# EAGLE design InductanceMeter_Rev1 (EAGLE 7.1.0)
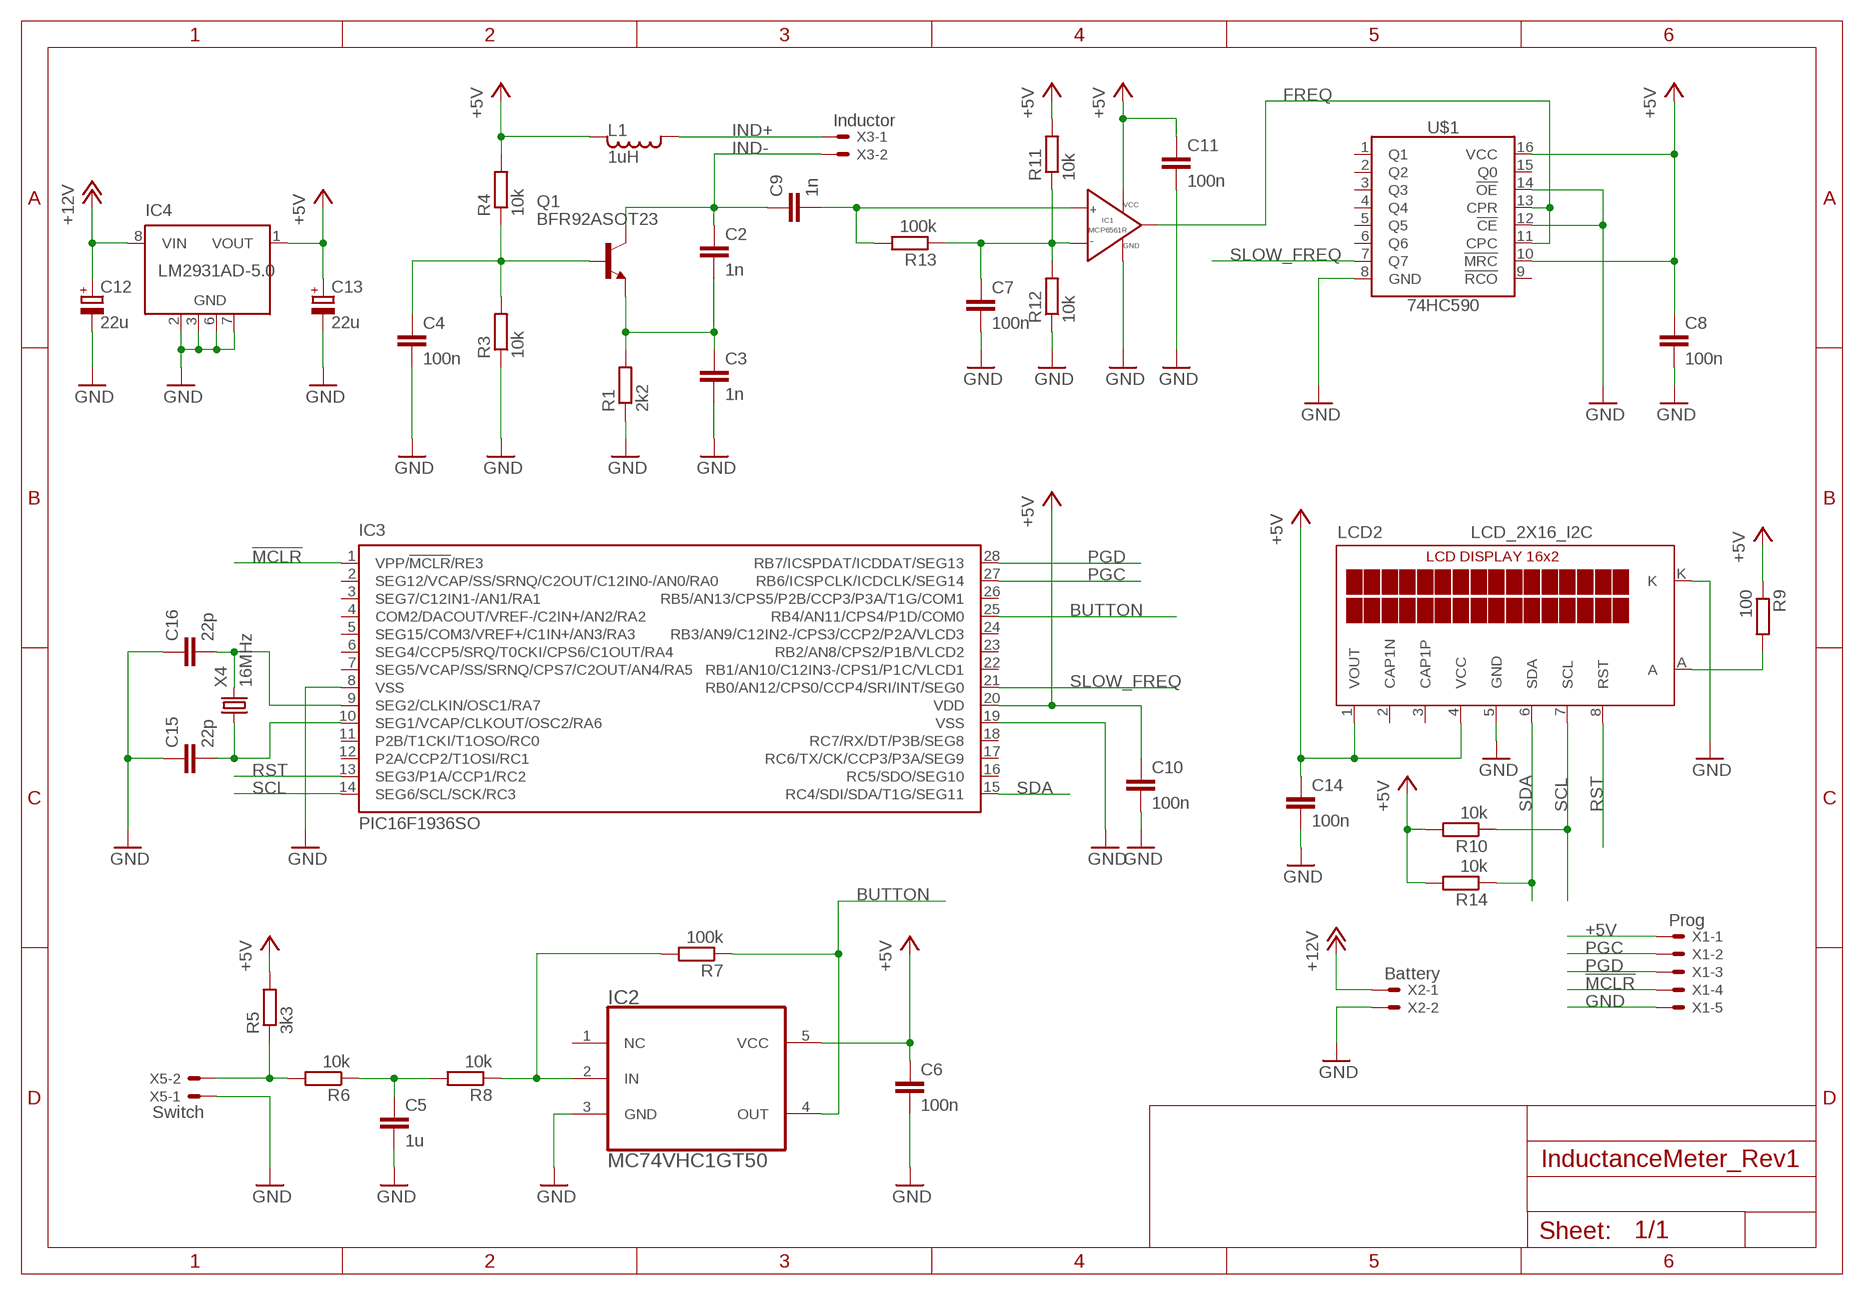
[diagram p0: schematic, sheet 1]

## Parts
C2  1n  CC0805  [C0805]
C3  1n  CC0805  [C0805]
C4  100n  CC0805  [C0805]
C5  1u  CC0805  [C0805]
C6  100n  CC0805  [C0805]
C7  100n  CC0805  [C0805]
C8  100n  CC0805  [C0805]
C9  1n  CC0805  [C0805]
C10  100n  CC0805  [C0805]
C11  100n  CC0805  [C0805]
C12  22u  C_POLARIZEDSMC_C  [SMC_C]
C13  22u  C_POLARIZEDSMC_C  [SMC_C]
C14  100n  CC0805  [C0805]
C15  22p  CC0805  [C0805]
C16  22p  CC0805  [C0805]
IC1  MCP6561R  [SOT-23-5]
IC2  MC74VHC1GT50  [SOT-23-5]
IC3  PIC16F1936SO  [SO28W]
IC4  LM2931AD-5.0  [SO8]
L1  1uH  INDUCTOR0805  [L0805]
LCD2  LCD_2X16_I2C  [LCD_2X16_I2C]
Q1  BFR92ASOT23  [SOT23]
R1  2k2  RESISTORR0805  [R0805]
R3  10k  RESISTORR0805  [R0805]
R4  10k  RESISTORR0805  [R0805]
R5  3k3  RESISTORR0805  [R0805]
R6  10k  RESISTORR0805  [R0805]
R7  100k  RESISTORR0805  [R0805]
R8  10k  RESISTORR0805  [R0805]
R9  100  RESISTORR0805  [R0805]
R10  10k  RESISTORR0805  [R0805]
R11  10k  RESISTORR0805  [R0805]
R12  10k  RESISTORR0805  [R0805]
R13  100k  RESISTORR0805  [R0805]
R14  10k  RESISTORR0805  [R0805]
U$1  74HC590  [SO16]
X1  Prog  22-23-2051  [22-23-2051]
X2  Battery  22-23-2021100MIL  [22-23-2021]
X3  Inductor  22-23-2021100MIL  [22-23-2021]
X4  16MHz  CRYSTAL  [CSM-7X-DU]
X5  Switch  22-23-2021100MIL  [22-23-2021]

## Nets
!MCLR!: IC3.1(VPP/!MCLR!/RE3) X1.4
+5V: C6.1 C8.1 C10.1 C11.1 C13.+ C14.1 IC1.2(VCC) IC2.5(VCC) IC3.20(VDD) IC4.1(VOUT) L1.2 LCD2.1(VOUT) LCD2.4(VCC) R4.2 R5.2 R9.1 R10.2 R11.2 R14.2 U$1.10(!MRC!) U$1.16(VCC) X1.1
+12V: C12.+ IC4.8(VIN) X2.1
BUTTON: IC2.4(OUT) IC3.25(RB4/AN11/CPS4/P1D/COM0) R7.1
FREQ: IC1.1(VOUT) U$1.11(CPC) U$1.13(CPR)
GND: C3.2 C4.2 C5.2 C6.2 C7.2 C8.2 C10.2 C11.2 C12.- C13.- C14.2 C15.1 C16.1 IC1.5(GND) IC2.3(GND) IC3.8(VSS) IC3.19(VSS) IC4.2(GND) IC4.3(GND) IC4.6(GND) IC4.7(GND) LCD2.5(GND) LCD2.K R1.1 R3.1 R12.1 U$1.8(GND) U$1.12(!CE!) U$1.14(!OE!) X1.5 X2.2 X5.1
IND+: L1.1 X3.1
IND-: C2.1 C9.1 Q1.3(C) X3.2
N$2: C16.2 IC3.9(SEG2/CLKIN/OSC1/RA7) X4.2
N$3: C2.2 C3.1 Q1.2(E) R1.2
N$4: C4.1 Q1.1(B) R3.2 R4.1
N$5: LCD2.A R9.2
N$6: C5.1 R6.1 R8.2
N$7: R5.1 R6.2 X5.2
N$8: IC2.2(IN) R7.2 R8.1
N$9: C15.2 IC3.10(SEG1/VCAP/CLKOUT/OSC2/RA6) X4.1
N$11: C7.1 IC1.4(VIN-) R11.1 R12.2 R13.1
N$12: C9.2 IC1.3(VIN+) R13.2
PGC: IC3.27(RB6/ICSPCLK/ICDCLK/SEG14) X1.2
PGD: IC3.28(RB7/ICSPDAT/ICDDAT/SEG13) X1.3
RST: IC3.13(SEG3/P1A/CCP1/RC2) LCD2.8(RST)
SCL: IC3.14(SEG6/SCL/SCK/RC3) LCD2.7(SCL) R10.1
SDA: IC3.15(RC4/SDI/SDA/T1G/SEG11) LCD2.6(SDA) R14.1
SLOW_FREQ: IC3.21(RB0/AN12/CPS0/CCP4/SRI/INT/SEG0) U$1.7(Q7)
Unconnected: IC2.1(NC) IC3.2(SEG12/VCAP/SS/SRNQ/C2OUT/C12IN0-/AN0/RA0) IC3.3(SEG7/C12IN1-/AN1/RA1) IC3.4(COM2/DACOUT/VREF-/C2IN+/AN2/RA2) IC3.5(SEG15/COM3/VREF+/C1IN+/AN3/RA3) IC3.6(SEG4/CCP5/SRQ/T0CKI/CPS6/C1OUT/RA4) IC3.7(SEG5/VCAP/SS/SRNQ/CPS7/C2OUT/AN4/RA5) IC3.11(P2B/T1CKI/T1OSO/RC0) IC3.12(P2A/CCP2/T1OSI/RC1) IC3.16(RC5/SDO/SEG10) IC3.17(RC6/TX/CK/CCP3/P3A/SEG9) IC3.18(RC7/RX/DT/P3B/SEG8) IC3.22(RB1/AN10/C12IN3-/CPS1/P1C/VLCD1) IC3.23(RB2/AN8/CPS2/P1B/VLCD2) IC3.24(RB3/AN9/C12IN2-/CPS3/CCP2/P2A/VLCD3) IC3.26(RB5/AN13/CPS5/P2B/CCP3/P3A/T1G/COM1) LCD2.2(CAP1N) LCD2.3(CAP1P) U$1.1(Q1) U$1.2(Q2) U$1.3(Q3) U$1.4(Q4) U$1.5(Q5) U$1.6(Q6) U$1.9(!RCO!) U$1.15(Q0)

## Library data of the parts
C2-C11 C14-C16 = 00Capacitor:C: Capacitor
C12 C13 = 00Capacitor:C_POLARIZED
IC1 = 00OpAmp:MCP6561R: 1.8V Low-Power Push-Pull Output Comparator Propagation delay 80ns max
IC2 = 00Logic:MC74VHC1GT50: Non-Inverting Buffer / Level Shifter
IC3 = 00PIC:PIC16F19*: Flash-Based, 8-Bit CMOS Microcontroller; EEPROM: 256; FLASH: 8192; RAM: 512
IC4 = 00VoltageRegulator:LM2931*
L1 = 00Inductor:INDUCTOR
LCD2 = 00Display:LCD_2X16_I2C: 2x16 LCD with I2C interface
Q1 = 00Transistor:BFR92A
R1 R3-R14 = 00Resistor:RESISTOR: RESISTOR, European symbol
U$1 = 00Logic:74HC590: 8-bit binary counter with output register; 3-state
X1 = 00Connector:22-23-2051: .100" (2.54mm) Center Header - 5 Pin; MF: MOLEX; MPN: 22-23-2051; OC_FARNELL: 1462952; OC_NEWARK: 38C9178
X2 X3 X5 = 00Connector:22-23-2021: .100" (2.54mm) Center Header - 2 Pin; MF: MOLEX; MPN: 22-23-2021; OC_FARNELL: 1462926; OC_NEWARK: 25C3832
X4 = 00Crystal:CRYSTAL: Crystal

## Board
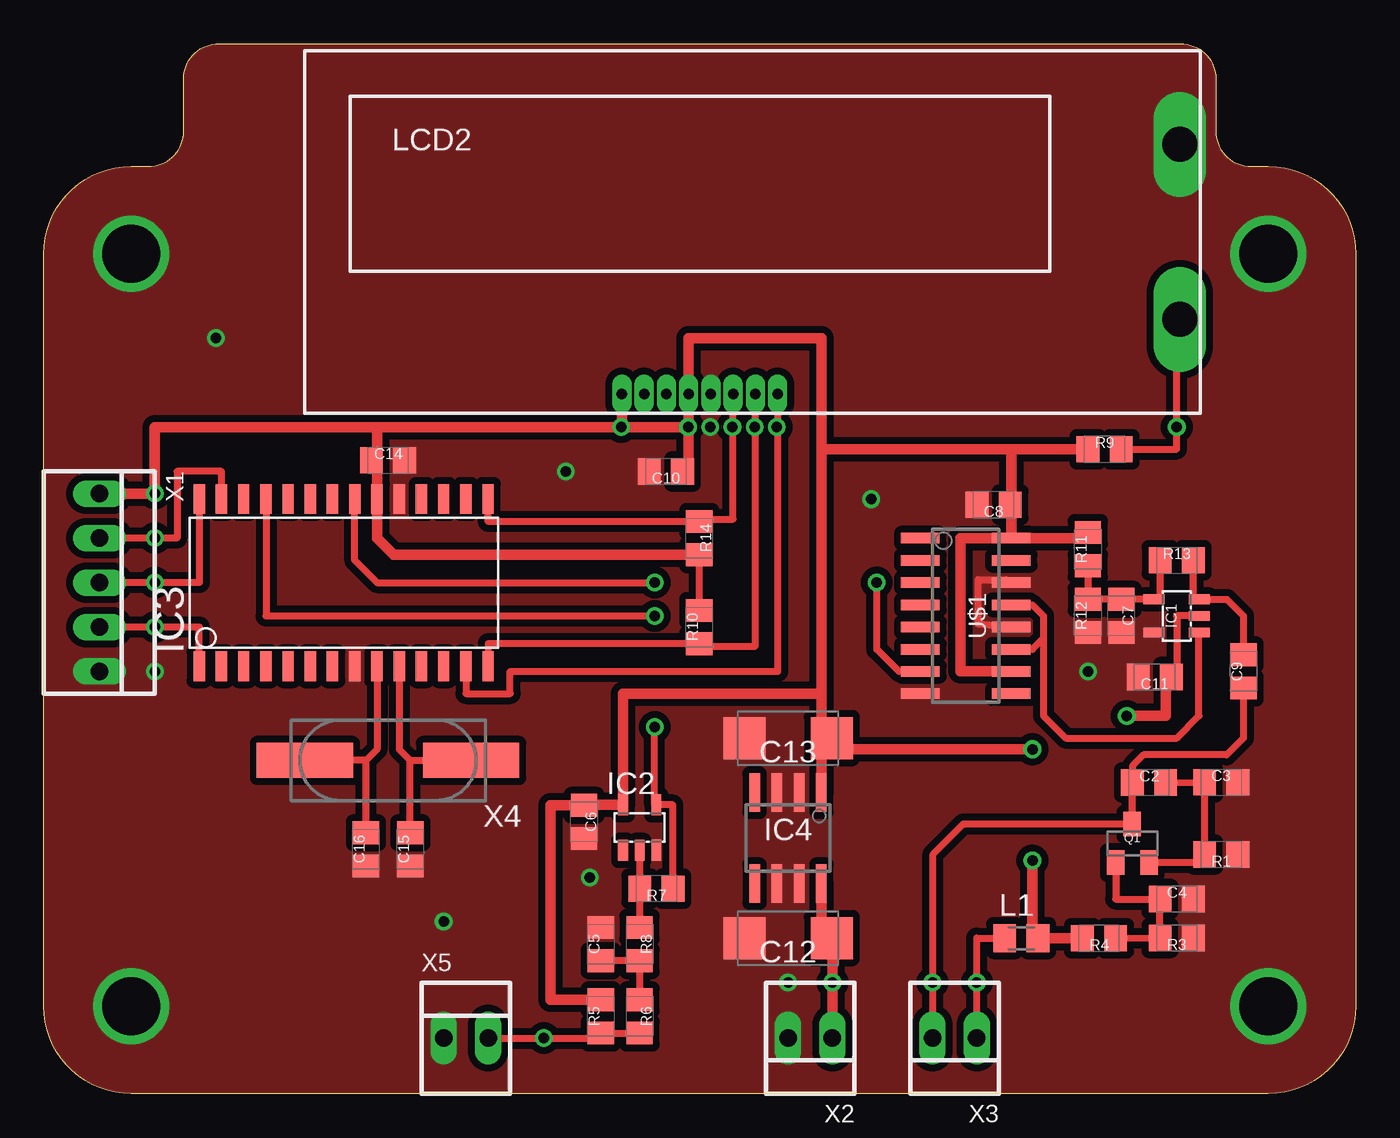
[diagram p1: board, top side]
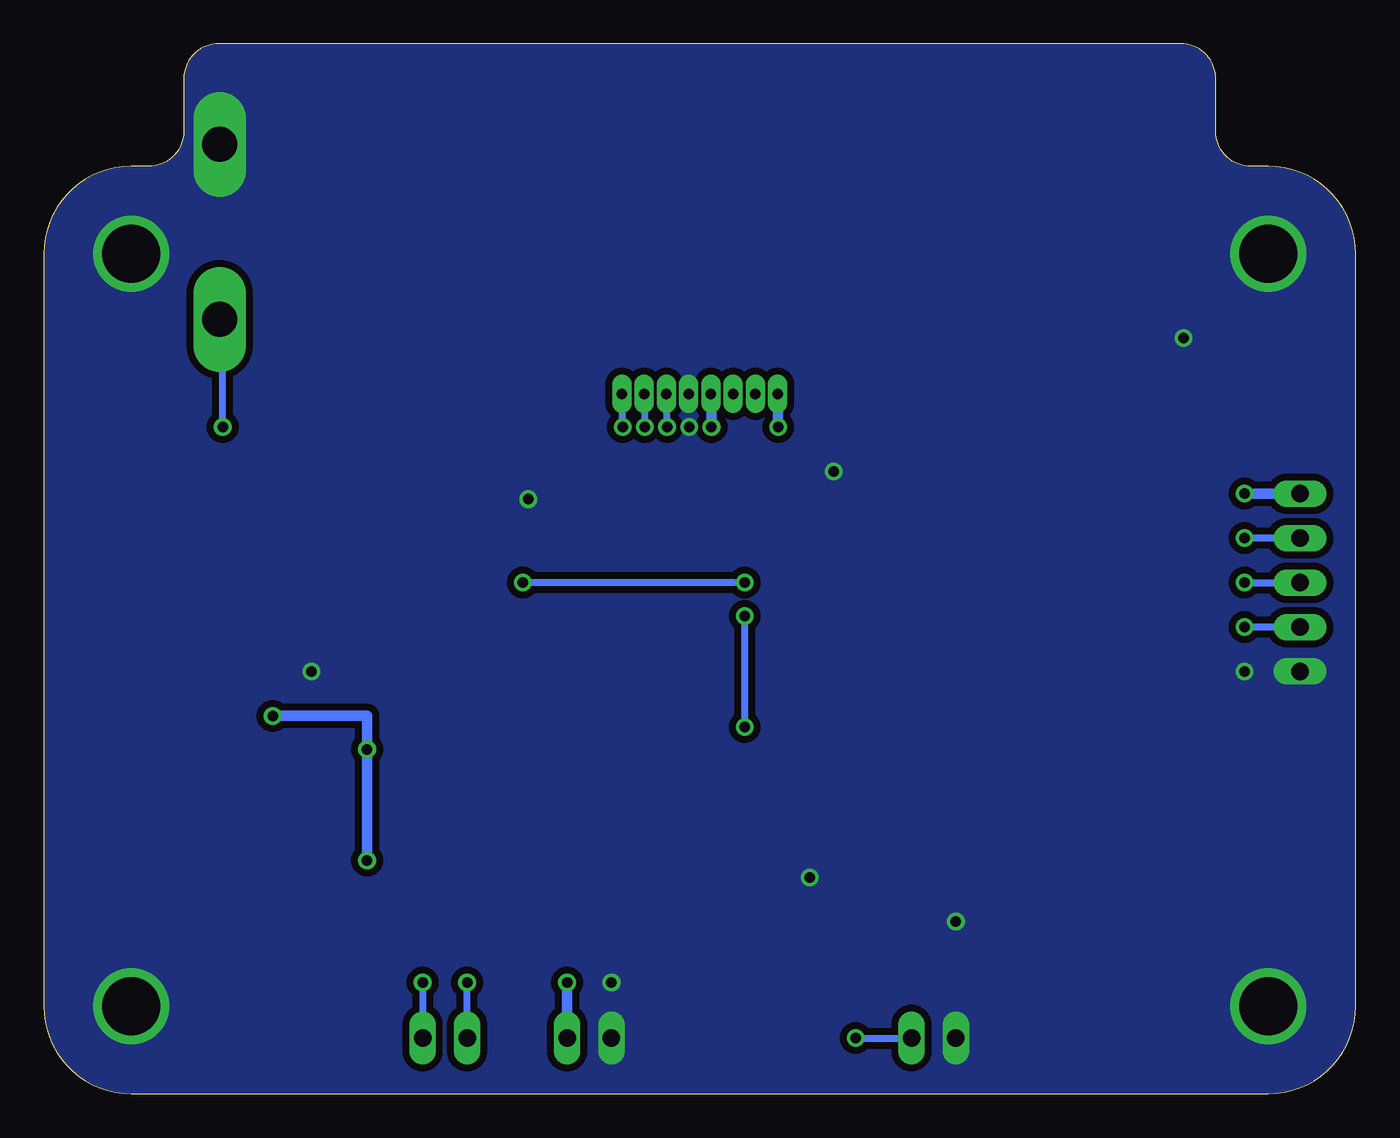
[diagram p2: board, bottom side, seen from below]

Size 75 x 60 mm. Coordinates in mm from the lower left corner, seen from the top.
Outline: 0,48 arc-90 5,53 6,53 arc90 8,55 8,58 arc-90 10,60 65,60 arc-90 67,58 67,55 arc90 69,53 70,53 arc-90 75,48 75,5 arc-90 70,0 5,0 arc-90 0,5 0,48
Copper layers (1*16): Top 0.035mm / dielectric 1.5mm / Bottom 0.035mm
Design rules "default *": minimum track width 10mil, minimum drill 24mil, track to track 8mil, track to pad 8mil, pad to pad 8mil, via to via 8mil, smd to smd 8mil, copper to edge 0mil, drill to drill 8mil, minimum pad ring 10mil, minimum via ring 8mil, stop-mask expansion 4mil, vias tented up to drill 0mil, thermal gap 10mil

### Footprints (pad centres in the part's own frame; a part is rotated, then mirrored left to right if it is on the bottom)
C0805 = smd 1.3 x 1.5: 1 -0.95,0; 2 0.95,0
SMC_C = smd 2.4 x 2.4: + -2.5,0; - 2.5,0
SOT-23-5 = smd 0.55 x 1.2: 1 -0.95,-1.3; 2 0,-1.3; 3 0.95,-1.3; 4 0.95,1.3; 5 -0.95,1.3
SO28W = smd 0.65 x 1.7: 1 -7.62,-4.78; 2 -6.35,-4.78; 3 -5.08,-4.78; 4 -3.81,-4.78; 5 -2.54,-4.78; 6 -1.27,-4.78; 7 0,-4.78; 8 1.27,-4.78; 9 2.54,-4.78; 10 3.81,-4.78; 11 5.08,-4.78; 12 6.35,-4.78; 13 7.62,-4.78; 14 8.89,-4.78; 15 8.89,4.78; 16 7.62,4.78; 17 6.35,4.78; 18 5.08,4.78; 19 3.81,4.78; 20 2.54,4.78; 21 1.27,4.78; 22 0,4.78; 23 -1.27,4.78; 24 -2.54,4.78; 25 -3.81,4.78; 26 -5.08,4.78; 27 -6.35,4.78; 28 -7.62,4.78
SO8 = smd 2.2 x 0.6: 1 -2.6,1.905; 2 -2.6,0.635; 3 -2.6,-0.635; 4 -2.6,-1.905; 5 2.6,-1.905; 6 2.6,-0.635; 7 2.6,0.635; 8 2.6,1.905
L0805 = smd 1.3 x 1.6: 1 -0.95,0; 2 0.95,0
LCD_2X16_I2C = drill 0.6 pad 1 long: 1 18.155,1.1; 2 19.425,1.1; 3 20.695,1.1; 4 21.965,1.1; 5 23.235,1.1; 6 24.505,1.1; 7 25.775,1.1; 8 27.045,1.1 | drill 2 long: A 50.05,5.35; K 50.05,15.35
SOT23 = smd 1 x 1.4: 1 -0.95,-1.1; 2 0.95,-1.1; 3 0,1.1
R0805 = smd 1.3 x 1.5: 1 -0.95,0; 2 0.95,0
SO16 = smd 0.6 x 2.2: 1 -4.445,-2.6; 2 -3.175,-2.6; 3 -1.905,-2.6; 4 -0.635,-2.6; 5 0.635,-2.6; 6 1.905,-2.6; 7 3.175,-2.6; 8 4.445,-2.6; 9 4.445,2.6; 10 3.175,2.6; 11 1.905,2.6; 12 0.635,2.6; 13 -0.635,2.6; 14 -1.905,2.6; 15 -3.175,2.6; 16 -4.445,2.6
22-23-2051 = drill 1 long: 1 -5.08,0; 2 -2.54,0; 3 0,0; 4 2.54,0; 5 5.08,0
22-23-2021 = drill 1 long: 1 -1.27,0; 2 1.27,0
CSM-7X-DU = smd 5.5 x 2: 1 -4.75,0; 2 4.75,0

### Placement (x,y rotation side)
C2  63.18,17.78 0 top
C3  67.3,17.8 0 top
C4  64.76,11.13 0 top
C5  31.84,8.54 90 top
C6  30.89,15.53 270 top
C7  61.59,27.3 270 top
C8  54.29,33.66 180 top
C9  68.58,24.13 90 top
C10  35.56,35.56 180 top
C11  63.5,23.81 180 top
C12  42.55,8.89 180 top
C13  42.55,20.32 180 top
C14  19.68,36.2 0 top
C15  20.95,13.97 90 top
C16  18.41,13.97 90 top
IC1  64.77,27.3 90 top
IC2  34.06,15.21 0 top
IC3  16.51,29.21 0 top
IC4  42.55,14.61 270 top
L1  55.88,8.89 0 top
LCD2  14.9,38.9 0 top
Q1  62.22,14.3 0 top
R1  67.3,13.67 180 top
R3  64.76,8.9 180 top
R4  60.33,8.89 180 top
R5  31.84,4.42 90 top
R6  34.06,4.42 270 top
R7  35.02,11.72 180 top
R8  34.06,8.54 270 top
R9  60.64,36.83 0 top
R10  37.47,26.67 90 top
R11  59.69,31.11 90 top
R12  59.69,27.3 90 top
R13  64.77,30.48 0 top
R14  37.47,31.75 270 top
U$1  52.7,27.3 270 top
X1  3.17,29.21 270 top
X2  43.81,3.17 180 top
X3  52.07,3.17 180 top
X4  19.68,19.05 180 top
X5  24.13,3.17 0 top

### Tracks (layer width: path | path; a pad name or v marks a point on that pad's centre or on a via)
!MCLR!  (via drill 0.6)
  Top 0.406: X1.4 v6.35,26.67 8.89,26.67 IC3.1
  Bottom 0.406: X1.4 v6.35,26.67
+5V  (via drill 0.6)
  Top 0.406: 31.24,16.51 C6.1 | R14.2 R10.2 | IC1.2 64.77,27.3 64.77,24.13 C11.1
  Top 0.61: 59.68,8.9 R4.2 L1.2 arc-90 56.52,9.21 v56.52,13.34 | R5.2 28.98,5.37 28.98,16.48 31.24,16.48 31.24,16.51 IC2.5 33.11,22.86 44.45,22.86 | X1.1 v6.35,34.29 6.35,38.1 19.05,38.1 | 36.87,38.1 LCD2.4 36.87,43.18 44.45,43.18 44.45,36.83 | 36.87,38.1 33.05,38.1 | 33.05,38.1 19.05,38.1 | LCD2.1 33.05,38.1 | 55.3,36.83 44.45,36.83 | 44.45,36.83 44.45,22.86 | 44.45,22.86 44.45,20.32 | U$1.10 52.39,24.13 52.39,31.75 U$1.16 | U$1.16 55.3,33.66 | 55.3,33.66 C8.1 | 55.3,33.66 55.3,36.83 | U$1.16 59.38,31.75 arc90 R11.2 | 36.87,38.1 36.87,35.91 C10.1 | IC4.1 44.45,19.68 | C13.+ 44.45,20.32 | 44.45,20.32 44.45,19.68 | 44.45,19.68 v56.52,19.68 | C11.1 arc90 64.14,23.5 64.14,21.59 v61.91,21.59 | 55.3,36.83 R9.1 | 19.05,36.2 C14.1 | 19.05,36.2 19.05,38.1 | 19.05,36.2 IC3.20 19.05,31.75 20,30.8 R14.2
  Bottom 0.61: v36.83,38.1 36.83,39.97 arc-90 LCD2.4 | v33.02,38.1 33.02,39.97 arc-90 LCD2.1 | v6.35,34.29 X1.1 | v56.52,13.34 v56.52,19.68 56.52,21.59 v61.91,21.59
+12V  (via drill 0.6)
  Top 0.61: IC4.8 44.45,8.89 C12.+ 45.09,8.89 v45.09,6.35 X2.1
  Bottom 0.61: v45.09,6.35 X2.1
BUTTON  (via drill 0.6)
  Top 0.406: 35.9,11.21 R7.1 35.97,16.51 IC2.4 34.92,16.51 v34.92,20.95 | IC3.25 12.7,27.3 v34.92,27.3
  Bottom 0.406: v34.92,20.95 v34.92,27.3
FREQ
  Top 0.406: U$1.13 56.52,27.94 57.15,27.3 57.15,26.04 | 57.15,26.04 56.52,25.4 U$1.11 | 57.15,26.04 57.15,21.59 58.42,20.32 64.77,20.32 66.04,21.59 66.04,26.32 IC1.1
GND  (via drill 0.6, 3.3)
  Top 0.406: U$1.12 53.43,26.84 53.43,29.38 55.02,29.38
  other vias: 31.2,12.36 5,48 70,48 70,5 5,5 59.69,24.13 38.1,38.1 6.35,24.13 42.55,6.35 47.31,33.97 22.86,9.84 9.84,43.18 29.84,35.56
  pour Top (isolate 0.4, no thermals): 0,5 0,48 arc-90 5,53 6,53 arc90 8,55 8,58 arc-90 10,60 65,60 arc-90 67,58 67,55 arc90 69,53 70,53 arc-90 75,48 75,5 arc-90 70,0 5,0 arc-90
  pour Bottom (isolate 0.4, no thermals): 0,5 0,48 arc-90 5,53 6,53 arc90 8,55 8,58 arc-90 10,60 65,60 arc-90 67,58 67,55 arc90 69,53 70,53 arc-90 75,48 75,5 arc-90 70,0 5,0 arc-90
IND+  (via drill 0.6)
  Top 0.406: X3.1 v53.34,6.35 53.34,8.89 L1.1
  Bottom 0.406: v53.34,6.35 X3.1
IND-  (via drill 0.6)
  Top 0.406: C9.1 68.58,20.32 67.63,19.37 62.87,19.37 62.23,18.73 C2.1 62.22,17.8 Q1.3 52.55,15.4 50.8,13.65 v50.8,6.35 X3.2
  Bottom 0.406: X3.2 v50.8,6.35
N$2
  Top 0.406: IC3.9 19.05,19.68 18.41,19.05 | 18.41,19.05 X4.2 | C16.2 18.41,19.05
N$3
  Top 0.406: Q1.2 66.03,13.2 R1.2 C3.1 C2.2
N$4
  Top 0.406: R4.1 R3.2 C4.1 61.27,11.13 Q1.1
N$5  (via drill 0.6)
  Top 0.406: R9.2 64.77,36.83 v64.77,38.1 64.77,44.13
  Bottom 0.406: v64.77,38.1 64.77,44.07 LCD2.A
N$6
  Top 0.406: R6.1 R8.2 C5.1
N$7  (via drill 0.6)
  Top 0.406: R5.1 R6.2 | R5.1 31.76,3.47 | X5.2 v28.57,3.17 31.55,3.17 arc90 R5.1
  Bottom 0.406: v28.57,3.17 X5.2
N$8
  Top 0.406: IC2.2 R7.2 R8.1
N$9
  Top 0.406: IC3.10 20.32,19.68 20.95,19.05 | 20.95,19.05 X4.1 | C15.2 20.95,19.05
N$11
  Top 0.406: R11.1 R12.2 C7.1 IC1.4 63.82,28.25 R13.1
N$12
  Top 0.406: 65.84,30.01 R13.2 65.72,28.25 IC1.3 67.63,28.25 68.58,27.3 C9.2
PGC  (via drill 0.6)
  Top 0.406: X1.2 v6.35,31.75 7.62,31.75 7.62,35.56 10.16,35.56 IC3.27
  Bottom 0.406: X1.2 v6.35,31.75
PGD  (via drill 0.6)
  Top 0.406: X1.3 v6.35,29.21 8.89,29.21 IC3.28
  Bottom 0.406: v6.35,29.21 X1.3
RST  (via drill 0.6)
  Top 0.406: LCD2.8 41.95,24.13 26.67,24.13 26.67,22.86 24.13,22.86 IC3.13
  Bottom 0.406: v41.91,38.1 41.91,39.97 arc-90 LCD2.8
SCL  (via drill 0.6)
  Top 0.406: LCD2.7 40.67,25.59 37.47,25.59 R10.1 25.4,25.72 IC3.14
  Bottom 0.406: v40.64,38.1 40.64,39.97 arc-90 LCD2.7
SDA  (via drill 0.6)
  Top 0.406: LCD2.6 39.41,32.84 37.47,32.84 R14.1 25.4,32.7 IC3.15
  Bottom 0.406: v39.37,38.1 39.37,39.97 arc-90 LCD2.6
SLOW_FREQ  (via drill 0.6)
  Top 0.406: v34.92,29.21 19.05,29.21 17.78,30.48 IC3.21 | U$1.7 48.9,24.13 47.62,25.4 v47.62,29.21
  Bottom 0.406: v34.92,29.21 v47.62,29.21

### Text on the board
tText: Lukas Fässler 2015